# EAGLE design wt32_breakout_board_v21 (EAGLE 6.5.0)
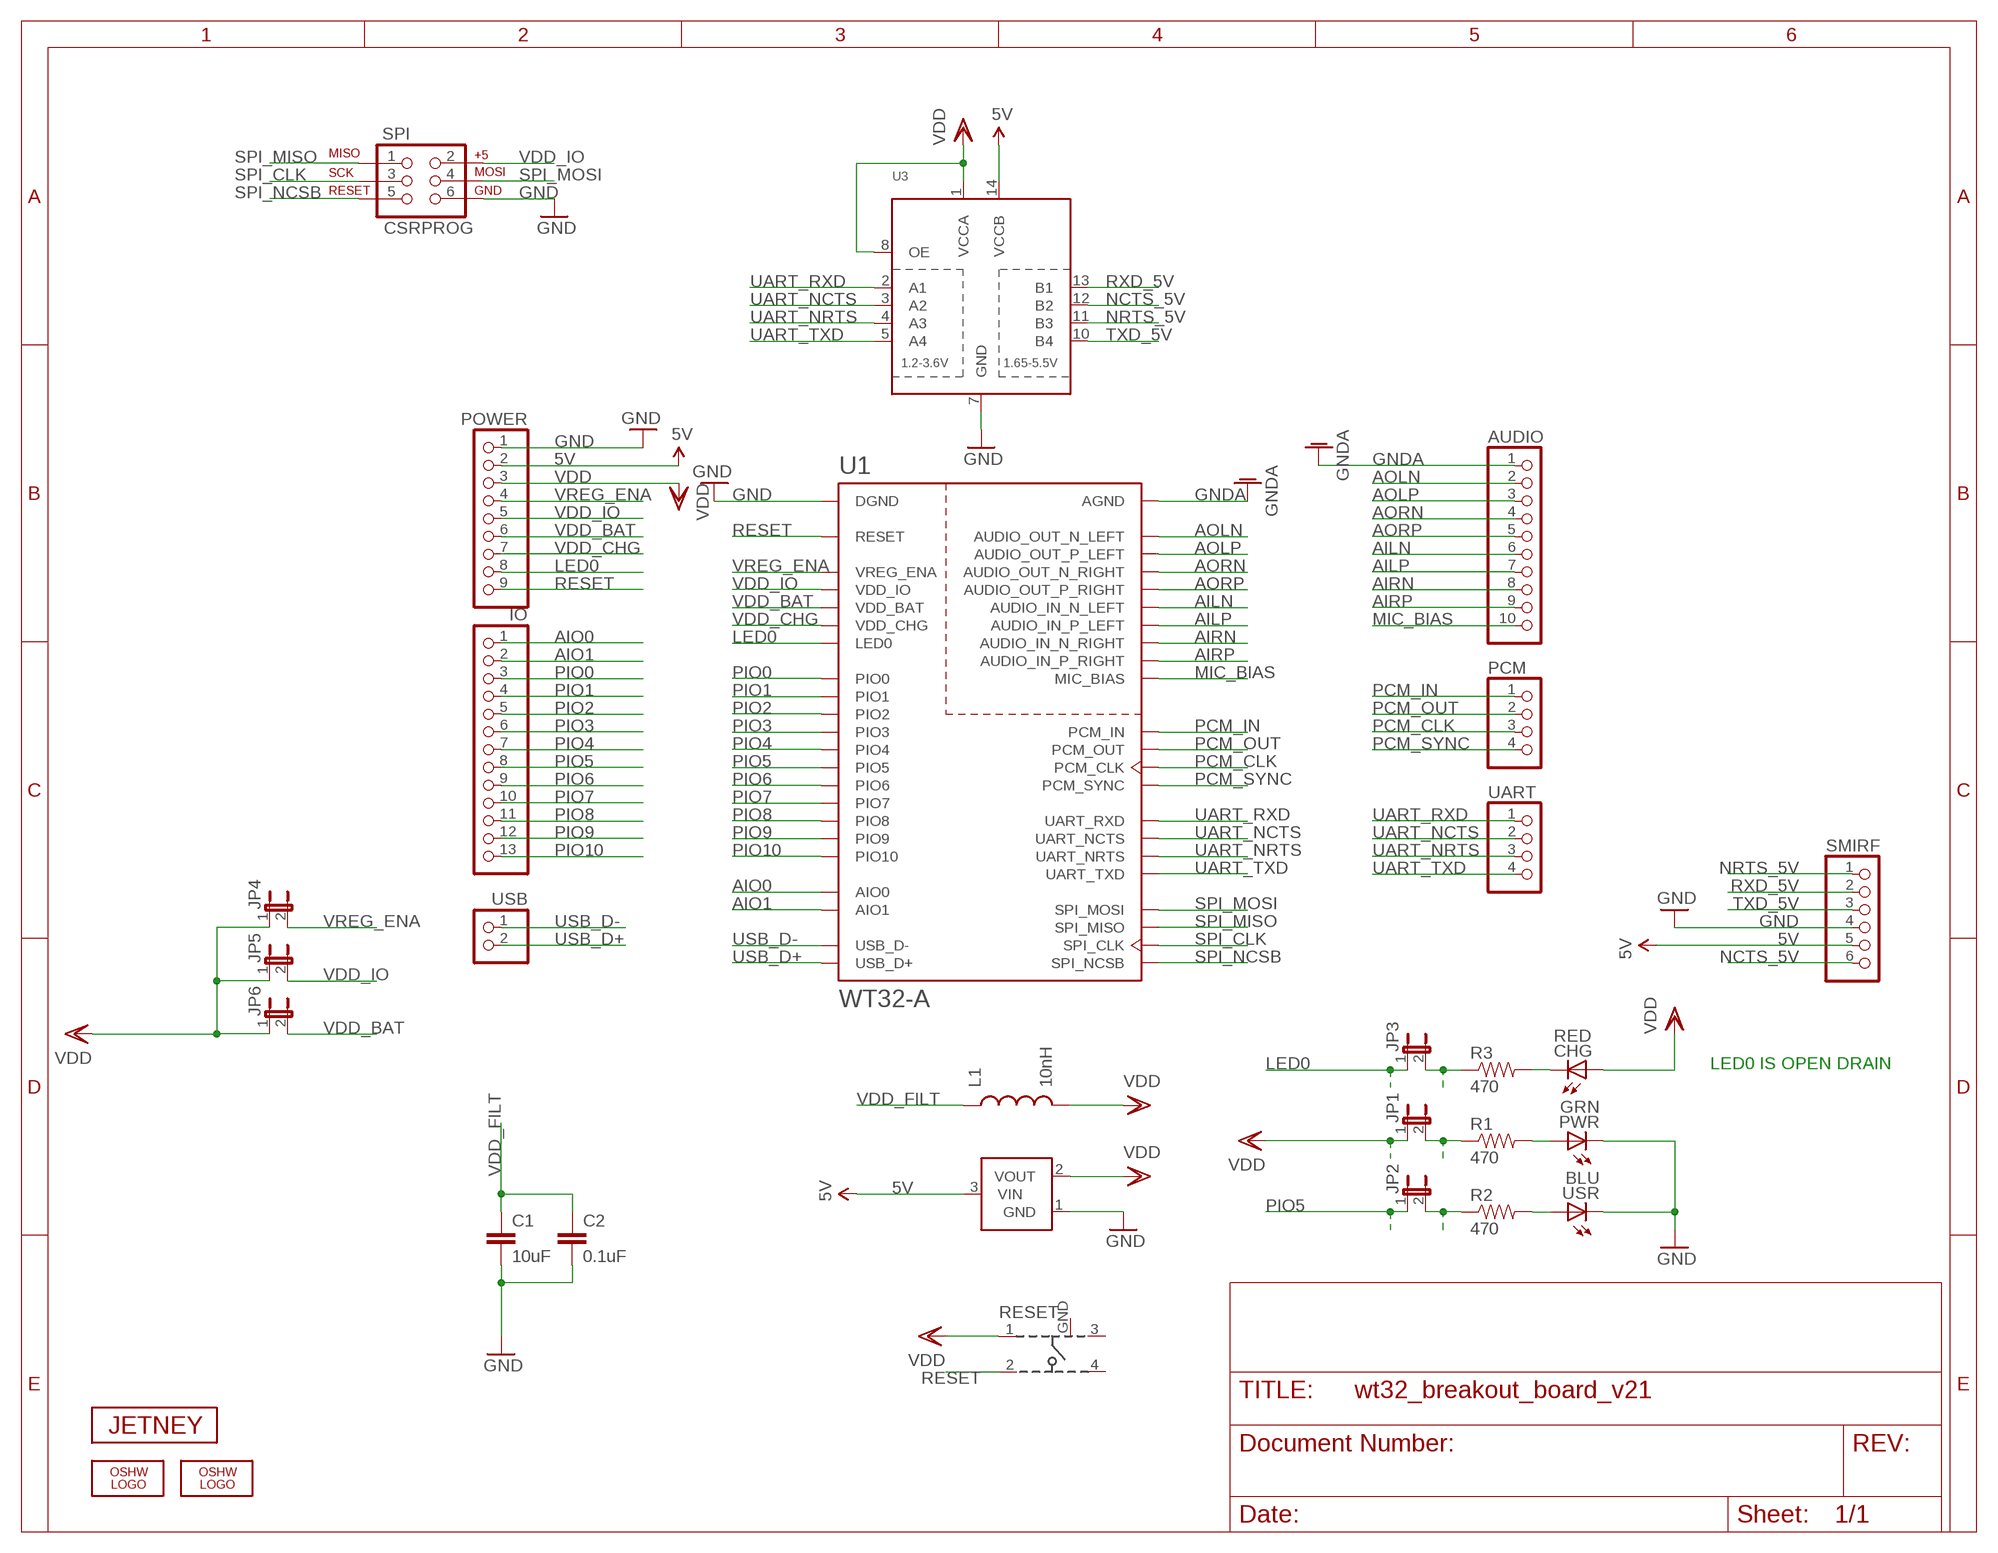
[diagram p0: schematic, sheet 1]

## Parts
AUDIO  PINHD-1X10  [1X10]
C1  10uF  CAP0603-CAP  [0603-CAP]
C2  0.1uF  CAP0603-CAP  [0603-CAP]
CHG  RED  LEDCHIPLED_0805  [CHIPLED_0805]
IO  PINHD-1X13  [1X13]
JP1  JUMPER-2SMD-NC  [SJ_2S]
JP2  JUMPER-2SMD-NC  [SJ_2S]
JP3  JUMPER-2SMD-NC  [SJ_2S]
JP4  JUMPER-2PTH  [1X02]
JP5  JUMPER-2PTH  [1X02]
JP6  JUMPER-2PTH  [1X02]
L1  10nH  INDUCTOR0603  [0603]
LOGO1  OSHW_LOGO_FILLX0070-NT  [OSHW_FILLX70_NOTEXT]
LOGO2  OSHW_LOGO_FILLX0070-NT  [OSHW_FILLX70_NOTEXT]
PCM  PINHD-1X4  [1X04]
POWER  PINHD-1X9  [1X09]
PWR  GRN  LEDCHIPLED_0805  [CHIPLED_0805]
R1  470  RESISTOR0603-RES  [0603-RES]
R2  470  RESISTOR0603-RES  [0603-RES]
R3  470  RESISTOR0603-RES  [0603-RES]
RESET  101-IG  [101-IG]
SMIRF  PINHD-1X6  [1X06]
SPI  CSRPROG  AVR_SPI_PRG_6PTH  [2X3]
U1  WT32-A  [WT32-A]
U2  MCP1700  [SOT23-3]
U3  TXB0104PWR  [TSSOP14]
U$2  JETNEY-LOGO-12  [JETNEY-LOGO-12]
UART  PINHD-1X4  [1X04]
USB  PINHD-1X2  [1X02]
USR  BLU  LEDCHIPLED_0805  [CHIPLED_0805]

## Nets
5V [power]: POWER.2 SMIRF.5 U2.3(VIN) U3.14(VCCB)
AILN: AUDIO.6 U1.AUDIO_IN_N_LEFT
AILP: AUDIO.7 U1.AUDIO_IN_P_LEFT
AIO0: IO.1 U1.AIO0
AIO1: IO.2 U1.AIO1
AIRN: AUDIO.8 U1.AUDIO_IN_N_RIGHT
AIRP: AUDIO.9 U1.AUDIO_IN_P_RIGHT
AOLN: AUDIO.2 U1.AUDIO_OUT_N_LEFT
AOLP: AUDIO.3 U1.AUDIO_OUT_P_LEFT
AORN: AUDIO.4 U1.AUDIO_OUT_N_RIGHT
AORP: AUDIO.5 U1.AUDIO_OUT_P_RIGHT
GND [power]: C1.2 C2.2 POWER.1 PWR.C SMIRF.4 SPI.6 U1.DGND U1.DGND@2(DGND) U1.DGND@3(DGND) U1.DGND@4(DGND) U1.DGND@5(DGND) U2.1(GND) U3.7(GND) USR.C
GNDA: AUDIO.1 U1.AGND U1.AGND@2(AGND) U1.AGND@3(AGND)
LED0: JP3.1 POWER.8 U1.LED0
MIC_BIAS: AUDIO.10 U1.MIC_BIAS
N$1: PWR.A R1.2
N$2: CHG.C R3.2
N$3: R2.2 USR.A
N$4: JP2.2 R2.1
N$7: JP3.2 R3.1
NCTS_5V: SMIRF.6 U3.12(B2)
NRTS_5V: SMIRF.1 U3.11(B3)
PCM_CLK: PCM.3 U1.PCM_CLK
PCM_IN: PCM.1 U1.PCM_IN
PCM_OUT: PCM.2 U1.PCM_OUT
PCM_SYNC: PCM.4 U1.PCM_SYNC
PIO0: IO.3 U1.PIO0
PIO1: IO.4 U1.PIO1
PIO2: IO.5 U1.PIO2
PIO3: IO.6 U1.PIO3
PIO4: IO.7 U1.PIO4
PIO5: IO.8 JP2.1 U1.PIO5
PIO6: IO.9 U1.PIO6
PIO7: IO.10 U1.PIO7
PIO8: IO.11 U1.PIO8
PIO9: IO.12 U1.PIO9
PIO10: IO.13 U1.PIO10
RESET: POWER.9 RESET.2 U1.RESET
RXD_5V: SMIRF.2 U3.13(B1)
SPI_CLK: SPI.3 U1.SPI_CLK
SPI_MISO: SPI.1 U1.SPI_MISO
SPI_MOSI: SPI.4 U1.SPI_MOSI
SPI_NCSB: SPI.5 U1.SPI_NCSB
TXD_5V: SMIRF.3 U3.10(B4)
UART_NCTS: U1.UART_NCTS U3.3(A2) UART.2
UART_NRTS: U1.UART_NRTS U3.4(A3) UART.3
UART_RXD: U1.UART_RXD U3.2(A1) UART.1
UART_TXD: U1.UART_TXD U3.5(A4) UART.4
USB_D+: U1.USB_D+ USB.2
USB_D-: U1.USB_D- USB.1
VDD [power]: CHG.A JP1.1 JP4.1 JP5.1 JP6.1 L1.2 POWER.3 RESET.1 U2.2(VOUT) U3.1(VCCA) U3.8(OE)
VDD_BAT [power]: JP6.2 POWER.6 U1.VDD_BAT
VDD_CHG: POWER.7 U1.VDD_CHG
VDD_FILT [power]: C1.1 C2.1 L1.1
VDD_IO: JP5.2 POWER.5 SPI.2 U1.VDD_IO
VDDJP1 [power]: JP1.2 R1.1
VREG_ENA: JP4.2 POWER.4 U1.VREG_ENA
Unconnected: RESET.3 RESET.4

## Notes on the sheet
- LED0 IS OPEN DRAIN

## Power pins joined to a net without a drawn wire
GND: RESET.GND

## Library data of the parts
AUDIO = sf-pinhead:PINHD-1X10: PIN HEADER
C1 C2 = SparkFun:CAP: Capacitor Standard 0603 ceramic capacitor, and 0.1" leaded capacitor.
CHG PWR USR = adafruit:LED: LED OSRAM: - CHIPLED LG R971, LG N971, LY N971, LG Q971, LY Q971, LO R971, LY R971 LH N974, LH R974 LS Q976, LO Q976, LY Q976 LO Q996 - Hyper CHIPLED LW Q18S LB Q993, LB Q99A, LB R99A - SideLED LS A670, LO A670, LY A670, LG A670, LP A670 LB A673, LV A673, LT A673, LW A673 LH A674 LY A675 LS A676, LA A676, LO A676, LY A676, LW A676 LS A679, LY A679, LG A679 - Hyper Micro SIDELED® LS Y876, LA Y876, LO Y876, LY Y876 LT Y87S - SmartLED LW L88C, LW L88S LB L89C, LB L89S, LG L890 LS L89K, LO L89K, LY L89K LS L896, LA L896, LO L896, LY L896 - TOPLED LS T670, LO T670, LY T670, LG T670, LP T670 LSG T670, LSP T670, LSY T670, LOP T670, LYG T670 LG T671, LOG T671, LSG T671 LB T673, LV T673, LT T673, LW T673 LH T674 LS T676, LA T676, LO T676, LY T676, LB T676, LH T676, LSB T676, LW T676 LB T67C, LV T67C, LT T67C, LS T67K, LO T67K, LY T67K, LW E67C LS E67B, LA E67B, LO E67B, LY E67B, LB E67C, LV E67C, LT E67C LW T67C LS T679, LY T679, LG T679 LS T770, LO T770, LY T770, LG T770, LP T770 LB T773, LV T773, LT T773, LW T773 LH T774 LS E675, LA E675, LY E675, LS T675 LS T776, LA T776, LO T776, LY T776, LB T776 LHGB T686 LT T68C, LB T68C - Hyper Mini TOPLED® LB M676 - Mini TOPLED Santana® LG M470 LS M47K, LO M47K, LY M47K Source: http://www.osram.convergy.de/
IO = sf-pinhead:PINHD-1X13: PIN HEADER
JP1-JP6 = SparkFun:JUMPER-2: Jumper Basic 0.1" spaced jumper. Use with breakaway headers.
L1 = SparkFun:INDUCTOR: Inductors Basic Inductor/Choke - 0603 and 1206. Footprints are not proven and vary greatly between part numbers.
LOGO1 LOGO2 = oshw-logo:OSHW_LOGO_FILL
PCM UART = sf-pinhead:PINHD-1X4: PIN HEADER
POWER = sf-pinhead:PINHD-1X9: PIN HEADER
R1-R3 = SparkFun:RESISTOR: Resistor Basic schematic elements and footprints for 0603, 1206, and PTH resistors.
RESET = sf-keyglove:101-IG
SMIRF = sf-pinhead:PINHD-1X6: PIN HEADER
SPI = SparkFun:AVR_SPI_PRG_6: AVR ISP 6 Pin This is the reduced ISP connector for AVR programming. Common on Arduino. This footprint will take up less PCB space and can be used with a 10-pin to 6-pin adapter such as SKU: BOB-08508
U1 = sf-bluegiga:WT32: Bluegiga WT32 class 2 Bluetooth Audio module - Bluetooth 2.1 + EDR w/stereo analog audio (A2DP) support. WT32-A variant has an on-module ceramic chip antenna, WT32-E variant has W.Fl connector. WT32-A variant includes keepout/restrict area. Antenna edge of the module should be flush up against the edge of the PCB. See datasheet for variant layout details. The WT32 is a Bluetooth 2.1 + EDR module dedicated for Bluetooth audio applications. In addition to Bluetooth radio, antenna and iWRAP Bluetooth stack, the WT32 contains a DSP processor, a stereo audio codec and a battery charger making it ideal for portable battery Bluetooth stereo or hands-free audio applications. The WT32 constitutes an ideal solution for developers that want to quickly integrate the latest Bluetooth audio technologies into their design without investing several months into Bluetooth radio and stack development. In addition to the standard Bluetooth audio profiles, the WT32 can also support aptX® audio coding technology, offering outstanding Bluetooth Stereo audio quality, CVC audio enhancement software for hands-free applications and Apple iAP profile enabling OEMs, to create really unique and differentiated audio products. http://www.bluegiga.com/en-US/products/bluetooth-classic-modules/wt32-bluetooth--audio-module https://github.com/jrowberg/sf-oshw Last updated 2014-01-04 by Jeff Rowberg <jeff@rowberg.net>; ANTENNA: On-module ceramic chip antenna
U2 = nonolith:MCP1700: Voltage regulator
U3 = SparkFun-DigitalIC:TXB0104PWR: 4-Bit Bi-Directional Level Shifter 1.2V-3.6V (VCCA) to 1.65V-5.5V (VCCB) bi-directional level shifter with auto direction sensing. Max data rate - VCCA 1.8V: 20Mbps (50ns), VCCA 3.3V: 100Mbps (10ns) Digikey: 296-21929-1-ND (TSSOP) IC-11329
U$2 = sf-keyglove:JETNEY-LOGO
USB = sf-pinhead:PINHD-1X2: PIN HEADER

## Net classes
0 default: width 0.152 mm, drill 0.33 mm, clearance 0.152 mm
1 power: width 0.254 mm, drill 0.33 mm, clearance 0.152 mm

## Board
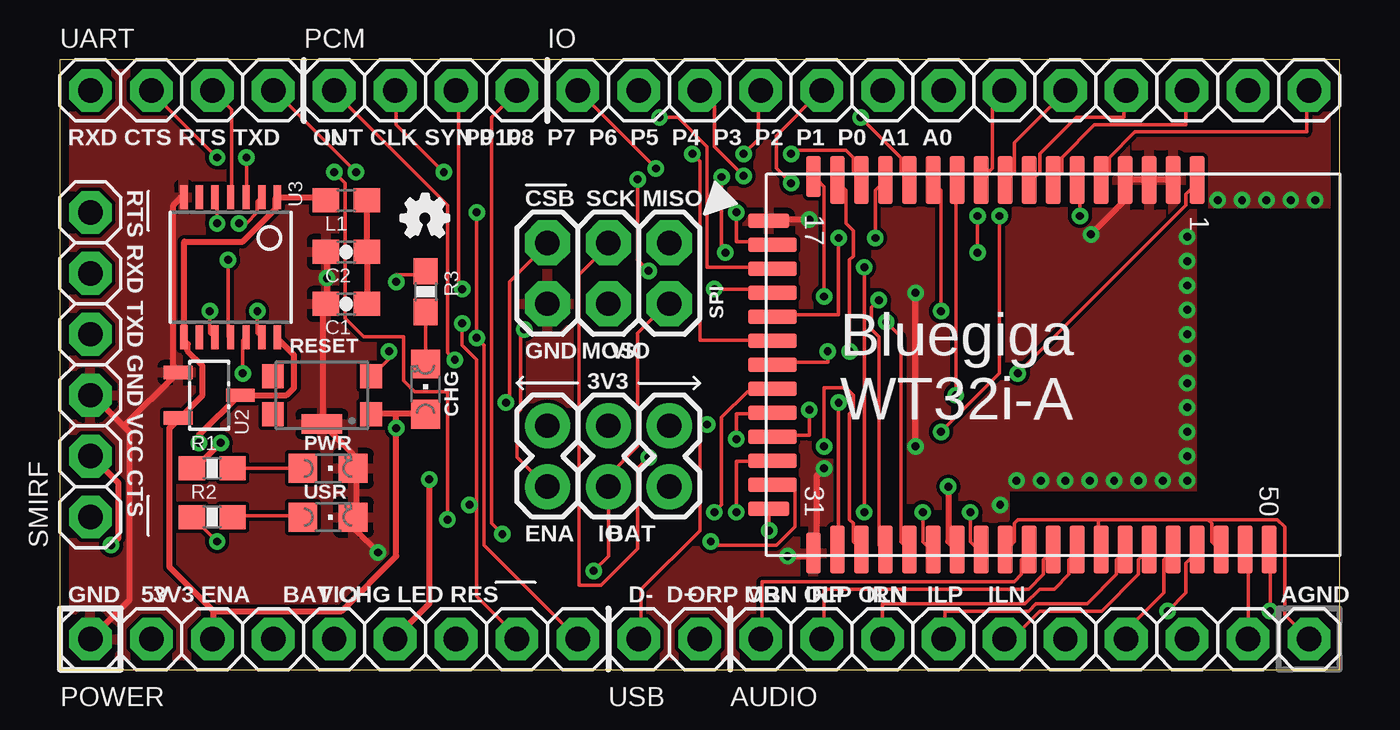
[diagram p1: board, top side]
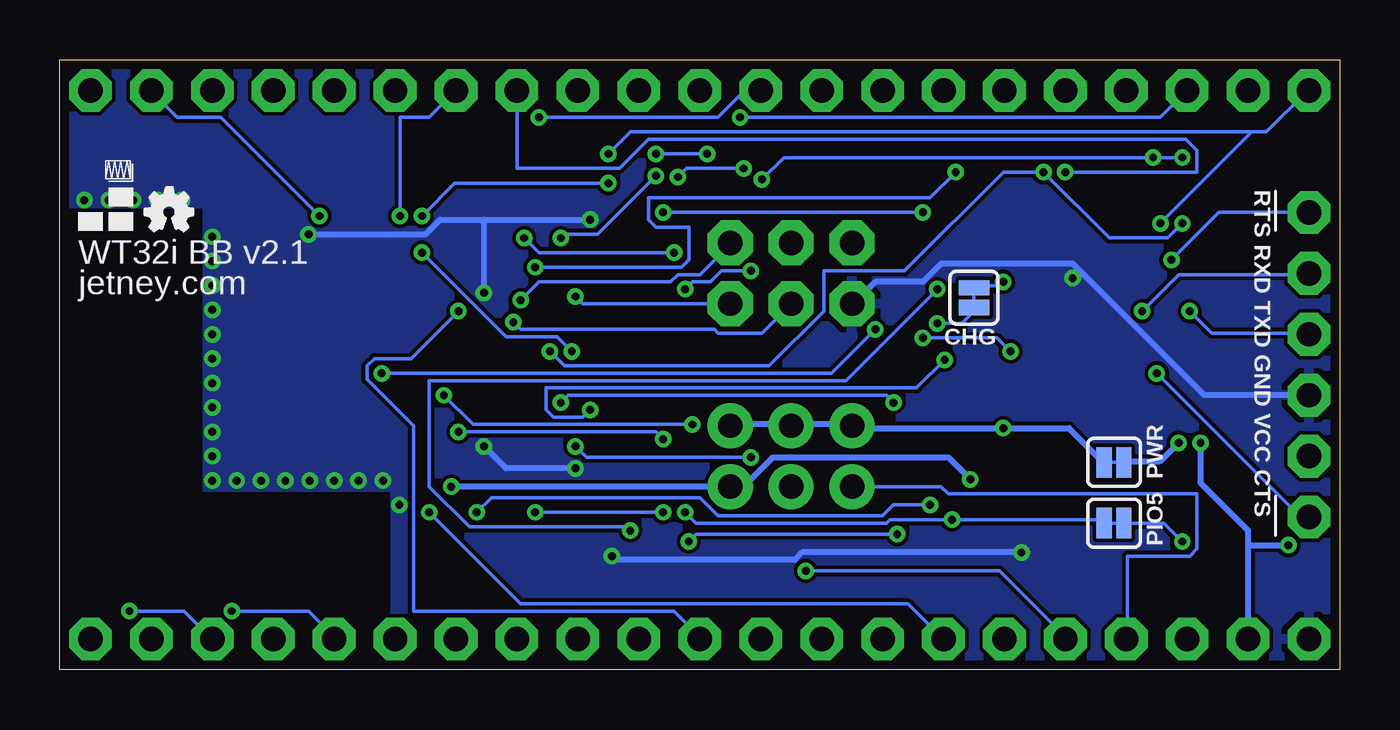
[diagram p2: board, bottom side, seen from below]

Size 53.34 x 25.4 mm. Coordinates in mm from the lower left corner, seen from the top.
Outline: 0,0 53.34,0 53.34,25.4 0,25.4 0,0
Copper layers (1*16): Top 0.0356mm / dielectric 1.5011mm / Bottom 0.0356mm
Design rules "LaenPCBOrder *": minimum track width 6mil, minimum drill 13mil, track to track 6mil, track to pad 6mil, pad to pad 6mil, via to via 6mil, smd to smd 6mil, copper to edge 15mil, drill to drill 6mil, minimum pad ring 7mil, minimum via ring 7mil, stop-mask expansion 4mil, vias tented up to drill 13mil, thermal gap 10mil
vRestrict: area 2.5,5.1 to 3.8,20.3; area 10.2,7.1 to 11.7,7.6; area 10.2,9.1 to 11.7,9.7; area 16,10.7 to 16.5,12.2; area 19,11.7 to 26.7,12.4; area 19,5.3 to 26.7,6.1; area 0,21.8 to 53.3,22.6; area 0,2.8 to 53.3,3.6; area 19,13 to 26.7,13.7; area 19,19.3 to 26.7,20.1

### Footprints (pad centres in the part's own frame; a part is rotated, then mirrored left to right if it is on the bottom)
1X10 = drill 1.016 pad 1.778 octagon: 1 -11.43,0; 2 -8.89,0; 3 -6.35,0; 4 -3.81,0; 5 -1.27,0; 6 1.27,0; 7 3.81,0; 8 6.35,0; 9 8.89,0; 10 11.43,0
0603-CAP = smd 1.1 x 1: 1 -0.85,0; 2 0.85,0
CHIPLED_0805 = smd 1.2 x 1.2: A 0,-1.05; C 0,1.05
1X13 = drill 1.016 pad 1.778 octagon: 1 -15.24,0; 2 -12.7,0; 3 -10.16,0; 4 -7.62,0; 5 -5.08,0; 6 -2.54,0; 7 0,0; 8 2.54,0; 9 5.08,0; 10 7.62,0; 11 10.16,0; 12 12.7,0; 13 15.24,0
SJ_2S = smd 0.635 x 1.27: 1 -0.412,0; 2 0.412,0
1X02 = drill 1.016 pad 1.88: 1 0,0; 2 2.54,0
0603 = smd 1.1 x 1: 1 -0.85,0; 2 0.85,0
1X04 = drill 1.016 pad 1.778 octagon: 1 -3.81,0; 2 -1.27,0; 3 1.27,0; 4 3.81,0
1X09 = drill 1.016 pad 1.778 octagon: 1 -10.16,0; 2 -7.62,0; 3 -5.08,0; 4 -2.54,0; 5 0,0; 6 2.54,0; 7 5.08,0; 8 7.62,0; 9 10.16,0
0603-RES = smd 1.1 x 1: 1 -0.85,0; 2 0.85,0
101-IG = smd 0.9 x 1: 1 -2.05,0.8; 2 -2.05,-0.8; 3 2.05,0.8; 4 2.05,-0.8 | smd 1.7 x 0.8: GND 0,1.2
1X06 = drill 1.016 pad 1.778 octagon: 1 -6.35,0; 2 -3.81,0; 3 -1.27,0; 4 1.27,0; 5 3.81,0; 6 6.35,0
2X3 = drill 1.016 pad 1.88 octagon: 1 0,0; 2 0,2.54; 3 2.54,0; 4 2.54,2.54; 5 5.08,0; 6 5.08,2.54
WT32-A = smd 2 x 0.6: AGND 7.7,-2; AGND@2 7.7,2; AGND@3 7.7,7; AIO0 -7.7,2; AIO1 -7.7,1; AUDIO_IN_N_LEFT 7.7,4; AUDIO_IN_N_RIGHT 7.7,1; AUDIO_IN_P_LEFT 7.7,3; AUDIO_IN_P_RIGHT 7.7,0; AUDIO_OUT_N_LEFT 7.7,8; AUDIO_OUT_N_RIGHT 7.7,5; AUDIO_OUT_P_LEFT 7.7,9; AUDIO_OUT_P_RIGHT 7.7,6; DGND -7.7,5; DGND@2 -7.7,4; DGND@3 -7.7,3; LED0 7.7,-5; MIC_BIAS 7.7,-1; PIO0 -7.7,0; PIO1 -7.7,-1; PIO2 -7.7,-2; PIO3 -7.7,-3; PIO9 -7.7,-6; PIO10 -7.7,-7; SPI_CLK 7.7,-8; SPI_MISO 7.7,-7; SPI_MOSI 7.7,-6; SPI_NCSB 7.7,-9; UART_RXD -7.7,-8; UART_TXD -7.7,-9; USB_D+ -7.7,-5; USB_D- -7.7,-4; VDD_BAT 7.7,-4; VDD_CHG 7.7,-3; VREG_ENA -7.7,6 | smd 0.6 x 1.7: DGND@4 -6,-11.85; PCM_CLK 6,-11.85 | smd 1.7 x 0.6: DGND@5 7.85,-10; VDD_IO -7.85,-10 | smd 0.6 x 2: PCM_IN 3,-11.7; PCM_OUT 4,-11.7; PCM_SYNC 5,-11.7; PIO4 2,-11.7; PIO5 1,-11.7; PIO6 0,-11.7; PIO7 -1,-11.7; PIO8 -2,-11.7; RESET -5,-11.7; UART_NCTS -3,-11.7; UART_NRTS -4,-11.7
SOT23-3 = smd 0.55 x 1.2: 1 0.95,1.3; 2 -0.95,1.3; 3 0,-1.3
TSSOP14 = smd 0.305 x 0.991: 1 -1.95,-2.918; 2 -1.3,-2.918; 3 -0.65,-2.918; 4 0,-2.918; 5 0.65,-2.918; 6 1.3,-2.918; 7 1.95,-2.918; 8 1.95,2.918; 9 1.3,2.918; 10 0.65,2.918; 11 0,2.918; 12 -0.65,2.918; 13 -1.3,2.918; 14 -1.95,2.918
1X02' = drill 1.016 pad 1.778 octagon: 1 -1.27,0; 2 1.27,0

### Placement (x,y rotation side)
AUDIO  40.64,1.27 180 top
C1  11.94,15.24 180 top
C2  11.94,17.4 180 top
CHG  15.24,11.68 0 top
IO  36.83,24.13 180 top
JP1  9.4,8.64 0 bottom
JP2  9.4,6.1 0 bottom
JP3  15.24,15.49 90 bottom
JP4  20.32,10.16 270 top
JP5  22.86,10.16 270 top
JP6  25.4,10.16 270 top
L1  11.94,19.56 180 top
LOGO1  14.22,18.03 0 top
LOGO2  49.78,18.29 0 bottom
PCM  15.24,24.13 0 top
POWER  11.43,1.27 0 top
PWR  11.18,8.38 270 top
R1  6.35,8.38 0 top
R2  6.35,6.35 0 top
R3  15.24,15.75 270 top
RESET  10.92,11.43 180 top
SMIRF  1.27,12.7 270 top
SPI  25.4,17.78 180 top
U1  41.4,12.7 270 top
U2  6.22,11.43 90 top
U3  7.11,16.76 180 top
U$2  52.58,18.29 0 bottom
UART  5.08,24.13 0 top
USB  [1X02']  25.4,1.27 0 top
USR  11.18,6.35 270 top

### Tracks (layer width: path | path; a pad name or v marks a point on that pad's centre or on a via)
5V  (via drill 0.33)
  Top 0.254: U3.14 9.14,13.72 9.75,13.11 9.75,11.73 9.45,11.43 U2.3 7.47,11.43 5.79,9.75 v5.79,9.45 | v2.13,5.18 2.44,5.49 2.44,7.77 1.37,8.84 SMIRF.5
  Bottom 0.254: v5.79,9.45 5.79,7.77 3.81,5.79 3.81,5.18 | POWER.2 3.81,5.18 | 3.81,5.18 v2.13,5.18
AILN
  Top 0.152: U1.AUDIO_IN_N_LEFT 45.26,4.88 44.96,4.57 44.96,3.96 43.43,2.44 40.84,2.44 39.78,1.37 39.47,1.37 AUDIO.6
AILP
  Top 0.152: U1.AUDIO_IN_P_LEFT 44.35,4.88 44.04,4.57 44.04,3.96 42.82,2.74 40.69,2.74 40.39,2.44 36.88,2.44 36.88,1.37 AUDIO.7
AIO0
  Top 0.152: U1.AIO0 43.43,20.42 43.74,20.73 43.74,21.34 44.81,22.4 51.97,22.4 51.97,24.08 IO.1
AIO1  (via drill 0.33)
  Top 0.152: v42.52,18.9 42.52,20.27 U1.AIO1
  Bottom 0.152: v42.52,18.9 46.63,23.01 48.46,23.01 49.53,24.08 IO.2
AIRN
  Top 0.152: AUDIO.8 34.29,2.74 40.23,2.74 40.84,3.35 41.45,3.35 42.06,3.96 42.06,4.57 42.37,4.88 U1.AUDIO_IN_N_RIGHT
AIRP
  Top 0.152: U1.AUDIO_IN_P_RIGHT 41.3,4.88 41,4.57 41,3.96 40.39,3.35 31.85,3.35 31.85,1.37 AUDIO.9
AOLN
  Top 0.152: AUDIO.2 49.53,4.88 U1.AUDIO_OUT_N_LEFT
AOLP  (via drill 0.33)
  Top 0.152: v50.44,2.44 50.44,4.88 U1.AUDIO_OUT_P_LEFT
  Bottom 0.152: v50.44,2.44 48.16,2.44 AUDIO.3
AORN
  Top 0.152: U1.AUDIO_OUT_N_RIGHT 46.33,4.88 46.02,4.57 46.02,3.2 44.5,1.68 44.5,1.37 AUDIO.4
AORP  (via drill 0.33)
  Top 0.152: v46.18,2.44 46.94,3.2 46.94,4.42 47.4,4.88 U1.AUDIO_OUT_P_RIGHT
  Bottom 0.152: v46.18,2.44 42.98,2.44 41.91,1.37 AUDIO.5
GND  (via drill 0.33)
  Top 0.254: U3.7 5.03,19.66 4.72,19.36 4.72,12.65 4.88,12.5 U2.1 | 5.03,12.5 U2.1 | POWER.1 2.9,2.9 2.9,9.91 2.67,10.13 | 2.67,10.13 1.37,11.43 SMIRF.4 | 2.67,10.13 4.88,12.34 U2.1 | v31.24,18.75 29.57,18.75 U1.DGND@4 | v42.98,18.14 44.35,19.51 44.35,20.27 U1.DGND@3 44.5,20.42 45.26,20.42 U1.DGND@2 45.41,20.42 46.33,20.42 U1.DGND | C2.2 11.12,17.37 v11.12,16.31 11.12,15.24 C1.2 10.97,15.24 10.97,10.36 RESET.GND 10.97,10.21 12.19,8.99 12.19,8.38 PWR.C 12.34,8.38 12.34,6.4 USR.C 12.34,6.25 12.34,5.79 v13.26,4.88 | v30.33,4.72 31.39,4.72 U1.DGND@5 31.55,4.88 31.55,8.08 v31.85,8.38 | v35.66,9.3 v35.66,15.7
  Bottom 0.254: 10.74,16.54 5.64,11.43 SMIRF.4 | 10.74,16.54 11.12,16.92 16.61,16.92 17.37,16.15 19.36,16.15 20.27,15.24 SPI.6 | 35.66,18.75 37.49,18.75 38.1,18.14 v42.98,18.14 | 35.66,18.75 v31.24,18.75 | v30.33,4.72 30.18,4.57 22.71,4.57 22.4,4.88 v13.26,4.88 | v35.66,15.7 35.66,18.75 | v35.66,9.3 34.75,8.38 v31.85,8.38 | 10.74,16.54 10.97,16.31 v11.12,16.31
  other vias: 46.99,7.87 46.99,8.89 46.99,9.91 46.99,10.92 46.99,11.94 46.99,12.95 46.99,13.97 46.99,14.99 46.99,16 46.99,17.02 45.97,7.87 44.96,7.87 43.94,7.87 42.93,7.87 41.91,7.87 40.89,7.87 39.88,7.87 39.19,6.86 46.99,18.03 48.26,19.56 49.28,19.56 50.29,19.56 51.31,19.56 52.32,19.56
  pour Top: 0,25.4 53.34,25.4 53.34,7.62 39.37,7.62 39.37,0 0,0
  pour Bottom: 0,25.4 53.34,25.4 53.34,7.62 39.37,7.62 39.37,0 0,0
GNDA
  Top 0.152: 43.28,6.25 39.93,6.25 39.78,6.1 39.78,5.33 39.47,5.03 U1.AGND | 43.28,6.25 43.28,5.03 U1.AGND@2 | 47.85,6.25 48.01,6.1 48.01,5.33 48.31,5.03 U1.AGND@3 | 43.28,6.25 47.85,6.25 | AUDIO.1 51.05,2.29 51.05,5.94 50.75,6.25 47.85,6.25
LED0  (via drill 0.33)
  Top 0.152: v16.76,14.43 16.76,13.51 17.37,12.9 17.37,6.86 | 17.37,6.86 17.37,3.05 19.05,1.37 POWER.8 | v35.97,6.55 35.97,5.33 36.27,5.03 U1.LED0 | 17.37,6.86 v17.07,6.86
  Bottom 0.152: v16.76,14.43 15.75,14.43 15.24,14.94 JP3.1 | v35.97,6.55 35.36,7.16 26.67,7.16 25.91,6.4 19.05,6.4 18.59,6.86 v17.07,6.86
MIC_BIAS
  Top 0.152: U1.MIC_BIAS 40.39,4.88 40.08,4.57 40.08,3.96 39.78,3.66 29.26,3.66 29.26,1.37 AUDIO.10
N$1
  Top 0.152: PWR.A R1.2
N$2
  Top 0.152: CHG.C R3.2
N$3
  Top 0.152: R2.2 7.32,6.4 10.06,6.4 USR.A
N$4  (via drill 0.33)
  Top 0.152: v6.55,5.33 5.64,6.25 R2.1
  Bottom 0.152: v6.55,5.33 7.32,6.1 JP2.2
N$5
  Bottom 0.152: 9.14,6.1 9.65,6.1
N$6
  Bottom 0.152: 9.14,8.64 9.65,8.64
N$7  (via drill 0.33)
  Top 0.152: v14.02,16.15 14.02,16.46 15.24,16.46 R3.1
  Bottom 0.152: v14.02,16.15 14.17,16 15.24,16 JP3.2
N$8
  Bottom 0.152: 15.24,15.75 15.24,15.24
NCTS_5V  (via drill 0.33)
  Top 0.152: v7.62,12.34 7.62,13.72 U3.12
  Bottom 0.152: v7.62,12.34 1.68,6.4 1.37,6.4 SMIRF.6
NRTS_5V  (via drill 0.33)
  Top 0.152: v7.01,17.07 7.01,13.87 U3.11
  Bottom 0.152: v7.01,17.07 5.03,19.05 SMIRF.1
PCM_CLK  (via drill 0.33)
  Top 0.152: v29.57,5.79 29.57,6.55 U1.PCM_CLK | v16.76,15.85 16.61,16 16.61,24.08 PCM.3
  Bottom 0.152: v29.57,5.79 29.72,5.94 36.27,5.94 37.95,7.62 37.95,12.04 20.57,12.04 v16.76,15.85
PCM_IN  (via drill 0.33)
  Top 0.152: v31.24,10.82 31.24,9.75 29.72,9.75 U1.PCM_IN | v16.46,12.9 16.15,13.21 16.15,19.36 11.43,24.08 PCM.1
  Bottom 0.152: v31.24,10.82 31.55,10.52 32.77,10.52 33.07,10.82 33.07,11.73 17.63,11.73 v16.46,12.9
PCM_OUT  (via drill 0.33)
  Top 0.152: v28.19,6.55 28.19,8.69 29.57,8.69 U1.PCM_OUT | v33.53,16.76 v33.53,6.55 | v16,20.73 14.02,22.71 14.02,24.08 PCM.2
  Bottom 0.152: v33.53,6.55 v28.19,6.55 | v33.53,16.76 27.43,16.76 27.13,17.07 27.13,18.44 28.5,18.44 28.8,18.75 28.8,19.66 17.07,19.66 v16,20.73
PCM_SYNC  (via drill 0.33)
  Top 0.152: v27.13,5.33 27.13,5.18 29.87,5.18 30.63,5.94 30.63,7.62 29.72,7.62 U1.PCM_SYNC | v18.44,5.64 17.98,6.1 17.98,23.01 19.05,24.08 PCM.4
  Bottom 0.152: v27.13,5.33 26.82,5.64 v18.44,5.64
PIO0
  Top 0.152: U1.PIO0 41.45,20.42 41.76,20.73 41.76,21.34 43.13,22.71 46.94,22.71 46.94,24.08 IO.3
PIO1
  Top 0.152: U1.PIO1 40.54,20.42 40.84,20.73 40.84,21.49 42.37,23.01 44.35,23.01 44.35,24.08 IO.4
PIO2
  Top 0.152: U1.PIO2 39.47,20.42 39.78,20.73 39.78,21.95 41.91,24.08 IO.5
PIO3
  Top 0.152: IO.6 38.86,23.62 38.86,20.88 38.41,20.42 U1.PIO3
PIO4  (via drill 0.33)
  Top 0.152: v28.19,9.6 28.19,10.67 29.57,10.67 U1.PIO4 | v36.73,9.91 39.17,12.34 v39.17,18.9
  Bottom 0.152: v28.19,9.6 28.5,9.91 v36.73,9.91 | v39.17,18.9 39.17,23.01 37.95,23.01 IO.7
PIO5  (via drill 0.33)
  Top 0.152: v27.28,6.55 27.58,6.86 27.58,10.52 28.65,11.58 29.57,11.58 U1.PIO5 | v11.43,20.73 11.89,20.27 11.89,14.63 12.65,13.87 14.33,13.87 14.33,12.04 14.78,11.58 16.15,11.58 v16.15,6.25
  Bottom 0.152: v27.28,6.55 26.82,6.1 18.9,6.1 18.75,6.25 v16.15,6.25 10.06,6.25 9.91,6.1 JP2.1 | IO.8 34.29,20.88 30.02,20.88 28.8,22.1 6.4,22.1 5.94,21.64 5.94,20.73 v11.43,20.73
PIO6  (via drill 0.33)
  Top 0.152: v32,13.26 32,12.8 29.72,12.8 U1.PIO6 | v38.25,18.9 v38.25,17.37 | v30.48,20.27 29.87,20.88 29.87,22.25 IO.9
  Bottom 0.152: v32,13.26 32.61,13.87 34.75,13.87 v38.25,17.37 | v38.25,18.9 36.88,20.27 v30.48,20.27
PIO7  (via drill 0.33)
  Top 0.152: v26.36,21.49 26.67,21.18 26.67,13.72 29.57,13.72 U1.PIO7 | v28.5,21.49 29.11,22.1 29.11,24.08 IO.10
  Bottom 0.152: v28.5,21.49 v26.36,21.49
PIO8  (via drill 0.33)
  Top 0.152: v32.46,17.98 32.46,14.78 29.72,14.78 U1.PIO8 | v28.5,20.57 27.28,21.79 27.28,23.47 26.67,24.08 IO.11
  Bottom 0.152: v32.46,17.98 32.31,18.14 30.94,18.14 v28.5,20.57
PIO9  (via drill 0.33)
  Top 0.152: v33.38,23.01 35.05,21.34 35.05,20.73 35.36,20.42 U1.PIO9
  Bottom 0.152: v33.38,23.01 25.91,23.01 24.84,24.08 24.23,24.08 IO.12
PIO10  (via drill 0.33)
  Top 0.152: v33.98,17.98 33.98,19.96 34.29,20.27 U1.PIO10 | v27.74,17.37 27.58,17.53 v27.58,20.52 | IO.13 v24.84,20.88
  Bottom 0.152: v33.98,17.98 33.38,17.37 v27.74,17.37 | v27.58,20.52 27.23,20.88 v24.84,20.88
RESET  (via drill 0.33)
  Top 0.152: v13.72,13.26 13.72,12.95 13.11,12.34 RESET.2 | POWER.9 17.68,5.18 17.68,13.51 v17.37,13.82 v17.37,19.05 | v28.19,19.05 28.19,17.83 29.57,17.83 U1.RESET
  Bottom 0.152: v13.72,13.26 14.28,13.82 v17.37,13.82 | v17.37,19.05 v28.19,19.05
RXD_5V  (via drill 0.33)
  Top 0.152: v8.23,14.94 8.23,14.02 8.38,13.87 U3.13
  Bottom 0.152: v8.23,14.94 6.71,16.46 1.37,16.46 SMIRF.2
SPI_CLK  (via drill 0.33)
  Top 0.152: v31.85,9.3 31.85,11.73 32.77,11.73 33.07,11.43 33.07,10.82 32.92,10.67 32.92,6.25 33.07,6.1 33.07,5.33 33.38,5.03 U1.SPI_CLK | v24.54,8.84 24.08,8.38 24.08,5.03 22.55,3.5 21.64,3.5 21.64,16.46 22.86,17.68 SPI.3
  Bottom 0.152: v31.85,9.3 31.39,8.84 v24.54,8.84
SPI_MISO  (via drill 0.33)
  Top 0.152: v34.14,15.39 33.83,15.09 33.83,14.17 34.14,13.87 34.14,5.18 34.29,5.03 U1.SPI_MISO
  Bottom 0.152: v34.14,15.39 33.38,16.15 27.89,16.15 27.58,16.46 26.67,16.46 25.45,17.68 SPI.1
SPI_MOSI  (via drill 0.33)
  Top 0.152: v34.44,14.48 35.05,13.87 35.05,5.33 35.36,5.03 U1.SPI_MOSI
  Bottom 0.152: v34.44,14.48 34.14,14.17 26.06,14.17 25.91,14.02 24.08,14.02 SPI.4
SPI_NCSB  (via drill 0.33)
  Top 0.152: v32.46,11.12 32.46,5.03 U1.SPI_NCSB | v18.59,11.12 18.75,11.28 18.75,16.15 20.27,17.68 SPI.5
  Bottom 0.152: v32.46,11.12 32.16,11.43 18.9,11.43 v18.59,11.12
TXD_5V  (via drill 0.33)
  Top 0.152: v6.25,14.94 6.25,14.02 6.4,13.87 U3.10
  Bottom 0.152: v6.25,14.94 5.33,14.02 1.37,14.02 SMIRF.3
UART_NCTS  (via drill 0.33)
  Top 0.152: v27.28,15.85 29.57,15.85 U1.UART_NCTS | v24.54,16.61 24.08,17.07 v24.08,20.42 | v6.55,21.34 3.81,24.08 UART.2 | v7.77,21.34 7.77,19.81 U3.3
  Bottom 0.152: v27.28,15.85 26.98,16.15 26.21,16.15 25.76,16.61 v24.54,16.61 | v24.08,20.42 23.16,21.34 v7.77,21.34 v6.55,21.34
UART_NRTS  (via drill 0.33)
  Top 0.152: v24.99,23.01 25.76,23.01 26.98,21.79 26.98,16.76 29.57,16.76 U1.UART_NRTS | UART.3 7.16,23.32 7.16,19.81 U3.4
  Bottom 0.152: v24.99,23.01 7.47,23.01 UART.3
UART_RXD  (via drill 0.33)
  Top 0.152: v30.48,21.49 30.48,21.64 32.77,21.64 33.07,21.34 33.07,20.73 33.38,20.42 U1.UART_RXD | v7.47,18.59 7.77,18.59 8.23,19.05 8.23,19.51 8.38,19.66 U3.2
  Bottom 0.152: v30.48,21.49 29.57,22.4 3.66,22.4 | 3.66,22.4 3.05,22.4 1.37,24.08 UART.1 | 3.66,22.4 v7.47,18.59
UART_TXD  (via drill 0.33)
  Top 0.152: v32.92,13.26 32.92,17.07 33.07,17.22 33.07,18.29 32.77,18.59 32.77,19.96 32.46,20.27 U1.UART_TXD | v12.34,20.73 8.99,24.08 UART.4 | v6.55,18.59 6.55,19.66 U3.5
  Bottom 0.152: v32.92,13.26 32.31,12.65 23.77,12.65 21.49,14.94 21.49,16.61 18.14,16.61 14.02,20.73 v12.34,20.73 9.6,17.98 7.16,17.98 v6.55,18.59
USB_D+  (via drill 0.33)
  Top 0.152: v36.73,14.94 36.73,19.96 36.42,20.27 U1.USB_D+
  Bottom 0.152: v36.73,14.94 38.71,12.95 40.23,12.95 40.54,12.65 40.54,12.09 38.61,10.16 38.61,2.44 27.74,2.44 26.67,1.37 USB.2
USB_D-  (via drill 0.33)
  Top 0.152: v37.34,11.43 37.34,20.27 U1.USB_D- | v26.98,10.21 26.67,9.91 26.67,5.79 24.23,3.35 24.23,1.37 USB.1
  Bottom 0.152: v37.34,11.43 36.12,10.21 v26.98,10.21
VDD  (via drill 0.33)
  Top 0.254: L1.2 10.97,19.66 9.14,19.66 U3.1 8.99,19.66 8.99,19.2 7.62,17.83 5.18,17.83 5.18,13.87 U3.8 5.18,13.72 5.33,13.56 5.33,13.26 5.94,12.65 5.94,11.43 5.03,10.52 U2.2 4.88,10.36 4.57,10.06 4.57,4.27 6.4,2.44 | 14.02,10.67 15.24,10.67 CHG.A | 14.02,10.67 13.11,10.67 RESET.1 | 14.02,10.67 v14.02,10.06 14.02,4.72 11.73,2.44 6.4,2.44 | 6.4,2.44 6.4,1.37 POWER.3
  Bottom 0.254: JP1.1 9.91,8.69 11.28,10.06 v14.02,10.06 20.27,10.06 JP4.1 20.42,10.21 22.86,10.21 | 22.86,10.21 25.3,10.21 JP6.1 | 22.86,10.21 JP5.1
VDD_BAT  (via drill 0.33)
  Top 0.254: 37.49,5.03 U1.VDD_BAT 37.34,5.03 37.03,5.33 v37.03,7.62 | v15.39,7.92 15.39,2.74 14.02,1.37 POWER.6
  Bottom 0.254: v37.03,7.62 JP6.2 24.84,7.62 23.62,8.84 16.31,8.84 v15.39,7.92
VDD_CHG  (via drill 0.33)
  Top 0.152: 38.41,5.03 U1.VDD_CHG 38.25,5.03 37.95,5.33 v37.95,6.55
  Bottom 0.152: v37.95,6.55 34.14,2.74 17.98,2.74 POWER.7
VDD_FILT
  Top 0.254: C1.1 12.8,15.24 12.8,17.37 C2.1 12.8,17.53 12.8,19.51 L1.1
VDD_IO  (via drill 0.33)
  Top 0.152: 31.55,20.57 U1.VDD_IO 31.55,20.42 31.85,20.12 v31.85,15.54 | v22.25,4.12 22.86,4.72 JP5.2 22.86,8.08 24.08,9.3 24.08,14.02 25.3,15.24 SPI.2
  Bottom 0.152: v31.85,15.54 31.55,15.24 SPI.2 | v22.25,4.12 14.17,4.12 11.43,1.37 POWER.5
VDDJP1  (via drill 0.33)
  Top 0.254: v6.71,9.45 5.64,8.38 R1.1
  Bottom 0.254: v6.71,9.45 7.47,8.69 8.84,8.69 JP1.2
VREG_ENA  (via drill 0.33)
  Top 0.152: v39.93,12.34 46.94,19.36 46.94,19.81 47.4,20.27 U1.VREG_ENA | v19.36,14.17 19.2,14.02 19.2,10.82 19.05,10.67 19.05,8.84 20.27,7.62 JP4.2
  Bottom 0.152: v39.93,12.34 21.18,12.34 v19.36,14.17 | JP4.2 16.61,7.62 16.31,7.32 5.94,7.32 5.94,5.03 6.25,4.72 8.84,4.72 8.84,1.37 POWER.4

### Text on the board
tPlace: RXD CTS RTS TXD OUT CLK SYN P10 | IN P9 P8 P7 P6 P5 P4 P3 P2 P1 P0 A1 A0 | RTS RXD TXD GND VCC CTS | CSB | SCK | MISO | GND VIO | MOSI | 3V3 | Bluegiga / WT32i-A | ENA BAT | IO | GND 3V3 ENA BAT CHG LED RES ORP ORN OLP OLN | 5V | VIO | D- D+ | MBI | IRP | IRN | ILP | ILN | AGND
bPlace: RTS RXD TXD GND VCC CTS | WT32i BB v2.1 | jetney.com | CHG | PWR | PIO5